# Altium schematic sheet Sheet1.SchDoc
size A4
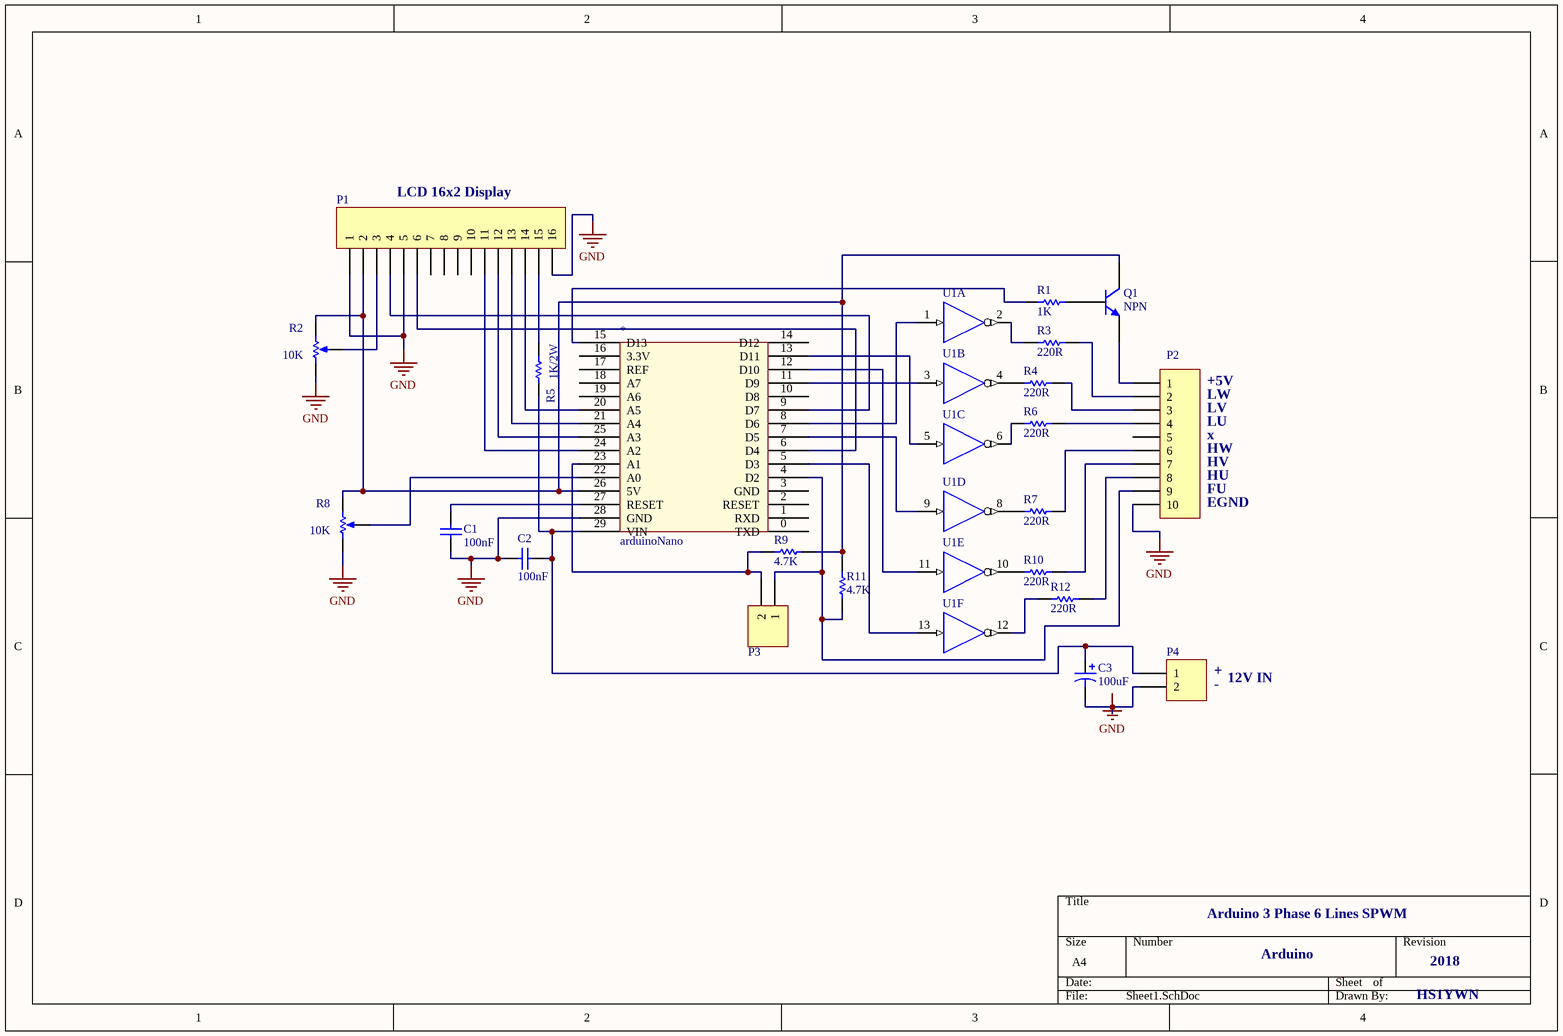
[diagram p0: Sheet1.SchDoc]

## Parts
*  arduinoNano  [Arduino nano]
C1  100nF  [CE_200]
C2  100nF  [CE_200]
C3  100uF  [CAN_150]
P1  Header 16  [HDR1X16]  (value not drawn)
P2  Header 10  [HDR1X10]  (value not drawn)
P3  Header 2  [HDR1X2]  (value not drawn)
P4  Header 2  [HDR1X2]  (value not drawn)
Q1  NPN  [TO-226-AA]
R1  1K  [AXIAL-0.3]
R2  10K  [VR5]
R3  220R  [AXIAL-0.3]
R4  220R  [AXIAL-0.3]
R5  1K/2W  [AXIAL-0.5]
R6  220R  [AXIAL-0.3]
R7  220R  [AXIAL-0.3]
R8  10K  [VR5]
R9  4.7K  [AXIAL-0.3]
R10  220R  [AXIAL-0.3]
R11  4.7K  [AXIAL-0.3]
R12  220R  [AXIAL-0.3]
U1  M74HC04M1R  [SO14_N]  (value not drawn)  (parts A,B,C,D,E,F of 6)

## Nets
GND: *.28(GND) C1.1 C2.2 P1.1 P1.5 P1.16 P2.10 R2.1(TOP) R8.1(TOP) U1.7(GND)
VCC: U1.14(VCC)
Net*_4: *.4(D2) P2.9 P3.1 R11.2
Net*_5: *.5(D3) U1.13(A)
Net*_6: *.6(D4) P1.6
Net*_7: *.7(D5) U1.9(A)
Net*_8: *.8(D6) U1.1(A)
Net*_9: *.9(D7) P1.4
Net*_11: *.11(D9) U1.3(A)
Net*_12: *.12(D10) U1.11(A)
Net*_13: *.13(D11) U1.5(A)
Net*_15: *.15(D13) R1.2
Net*_20: *.20(A5) P1.14
Net*_21: *.21(A4) P1.13
Net*_22: *.22(A0) R8.3(TAP)
Net*_23: *.23(A1) P3.2 R9.1
Net*_24: *.24(A2) P1.11
Net*_25: *.25(A3) P1.12
Net*_26: *.26(5V) P1.2 Q1.1(C) R2.2(BOT) R8.2(BOT) R9.2 R11.1
Net*_27: *.27(RESET) C1.2
Net*_29: *.29(VIN) C2.1 C3.1 P4.1 R5.1
NetC3_2: C3.2 P4.2
NetP1_3: P1.3 R2.3(TAP)
NetP1_15: P1.15 R5.2
NetP2_1: P2.1 Q1.3(E)
NetP2_2: P2.2 R3.1
NetP2_3: P2.3 R4.1
NetP2_4: P2.4 R6.1
NetP2_6: P2.6 R7.1
NetP2_7: P2.7 R10.1
NetP2_8: P2.8 R12.1
NetQ1_2: Q1.2(B) R1.1
NetR3_2: R3.2 U1.2(Y)
NetR4_2: R4.2 U1.4(Y)
NetR6_2: R6.2 U1.6(Y)
NetR7_2: R7.2 U1.8(Y)
NetR10_2: R10.2 U1.10(Y)
NetR12_2: R12.2 U1.12(Y)

Not connected (* = marked no-connect by the designer): * 0(TXD) 1(RXD) 2(RESET) 3(GND) 10(D8) 14(D12) 16(3.3V) 17(REF) 18(A7) 19(A6); P1 7 8 9 10; P2 5

## Notes on the sheet
- (near P1) LCD 16x2 Display
- (near P2) +5V
- (near P2) LW
- (near P2) LV
- (near P2) LU
- (near P2) x
- (near P2) HW
- (near P2) HV
- (near P2) HU
- (near P2) FU
- (near P2) EGND
- (near P4) -
- (near P4) +
- 12V IN
- Arduino 3 Phase 6 Lines SPWM
- Arduino
- 2018
- HS1YWN
- Labels drawn without touching a wire or pin: GND

## Library data of the parts
C1 C2 = Cap: Capacitor; Published: 8-Jun-2000; LatestRevisionDate: 17-Jul-2002; LatestRevisionNote: Re-released for DXP Platform.; PackageReference: RAD-0.3; Publisher: Altium Limited; PackageDescription: Radial Cap, Thru-Hole; 2 Leads; 0.3 in Pin Spacing; Value: 100nF
C3 = Cap Pol1: Capacitor (Radial); Published: 8-Jun-2000; LatestRevisionDate: 17-Jul-2002; LatestRevisionNote: Re-released for DXP Platform.; PackageReference: RB7.6-15; Publisher: Altium Limited; PackageDescription: Polarized Capacitor (Radial); 2 Leads; Value: 100uF
P1 = Header 16: Header, 16-Pin; LatestRevisionDate: 17-Jul-2002; LatestRevisionNote: Re-released for DXP Platform.; Publisher: Altium Limited
P2 = Header 10: Header, 10-Pin; LatestRevisionDate: 17-Jul-2002; LatestRevisionNote: Re-released for DXP Platform.; Publisher: Altium Limited
P3 P4 = Header 2: Header, 2-Pin; LatestRevisionDate: 17-Jul-2002; LatestRevisionNote: Re-released for DXP Platform.; Publisher: Altium Limited
Q1 = NPN: NPN Bipolar Transistor; Published: 8-Jun-2000; LatestRevisionDate: 17-Jul-2002; LatestRevisionNote: Re-released for DXP Platform.; PackageReference: TO-226-AA; Publisher: Altium Limited; PackageDescription: TO, Flat Index; 3 In-Line, Axial Leads; Body Dia. 4.8mm; Leads 0.55 x 0.51 mm (max); Code_JEDEC: TO-226-AA
R1 R3-R7 R9-R12 = Res1: Resistor; Published: 8-Jun-2000; LatestRevisionDate: 17-Jul-2002; LatestRevisionNote: Re-released for DXP Platform.; PackageReference: AXIAL-0.3; Publisher: Altium Limited; PackageDescription: Axial Device, Thru-Hole; 2 Leads; 0.3 in Pin Spacing
  R1: Value: 1K
  R3 R4 R6 R7 R10 R12: Value: 220R
  R5: Value: 1K/2W
  R9 R11: Value: 4.7K
R2 R8 = RPot: Potentiometer; Sim Note: Enter the Resistance value and the set point into parameter fields.; Set Position: 0.5; Published: 8-Jun-2000; LatestRevisionDate: 17-Jul-2002; LatestRevisionNote: Re-released for DXP Platform.; PackageReference: VR5; Publisher: Altium Limited; PackageDescription: Variable Resistor, Thru-Hole; 3 Leads; Value: 10K
U1 = M74HC04M1R: Hex Inverter; Published: 8-Jun-2000; LatestRevisionDate: 13-Apr-2006; LatestRevisionNote: IPC-7351 Footprint Added.; DatasheetVersion: Dec-1992; PackageVersion: Sep-1998; PackageReference: SO14; Publisher: Altium Limited; PackageDescription: 14-Pin Small Outline Integrated Circuit 1.27 mm Pitch; Code_IPC: SOIC127P600-14; ComponentLink1Description: Manufacturer Link; ComponentLink1URL: http://www.st.com/; ComponentLink2Description: Datasheet; ComponentLink2URL: http://www.st.com/stonline/products/literature/ds/1882/m74hc04.pdf